# Altium schematic sheet PowerSupply.SchDoc
size A4; DocumentNumber: 1; SheetNumber: 4; SheetTotal: 7
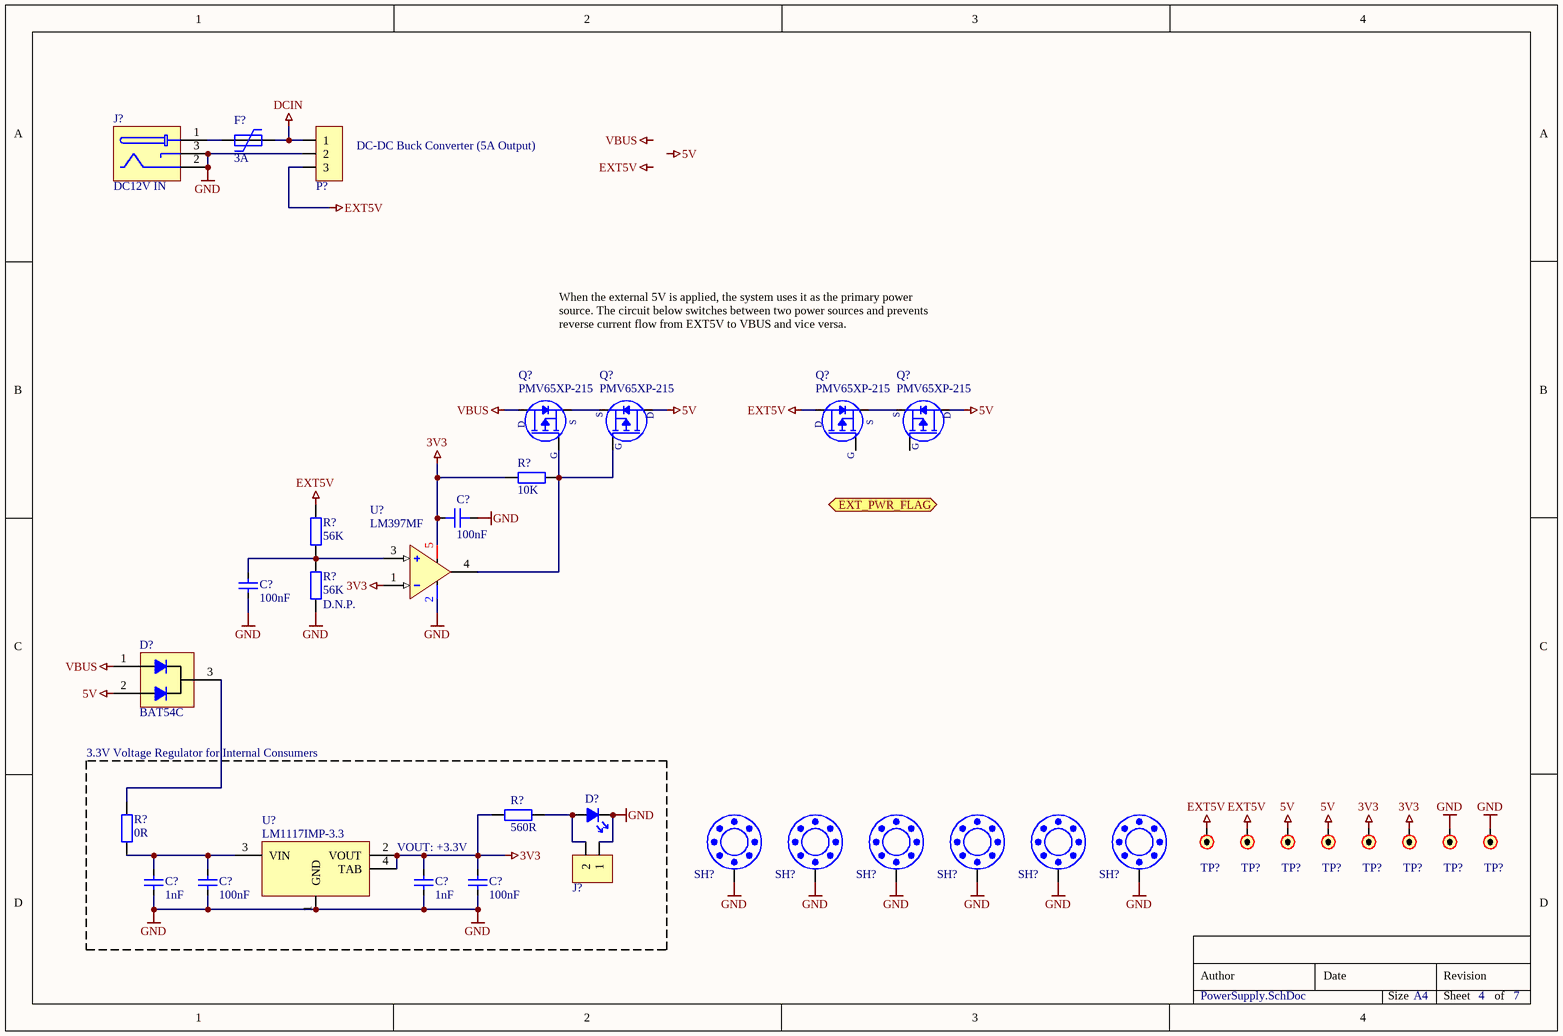
[diagram p0: PowerSupply.SchDoc]

## Parts
(Parts that share a designator on the sheet are numbered #1, #2 ... from top to bottom, then left to right.)
C?#1  100nF  [0603C_RF_M]
C?#2  100nF  [0603C_RF_M]
C?#3  1nF  [0603C_RF_M]
C?#4  100nF  [0603C_RF_M]
C?#5  1nF  [0603C_RF_M]
C?#6  100nF  [0603C_RF_M]
D?#1  BAT54C  [IRLML_SOT-23]
D?#2  LED  [0805LED_RF_M]  (value not drawn)
F?  3A  [BOURNS_MF-MSMF110/16-2_RF_H]
J?#1  DC12V IN  [CON JACK PWR 2.5mm PJ-002BH - duplicate]
J?#2  PINHDR_2x1  [HEADER-2.54-2P1]  (value not drawn)
P?  ED500XDS-3  [ED500XDS-3]  (value not drawn)
Q?#1  PMV65XP-215  [IRLML_SOT-23]
Q?#2  PMV65XP-215  [IRLML_SOT-23]
Q?#3  PMV65XP-215  [IRLML_SOT-23]
Q?#4  PMV65XP-215  [IRLML_SOT-23]
R?#1  10K  [0805R_RF_M]
R?#2  56K  [0805R_RF_M]
R?#3  56K  [0805R_RF_M]
R?#4  560R  [0603R_RF_M]
R?#5  0R  [0603R_RF_M]
SH?#1  SH-30/57  [SH\D3.0\S5.7]  (value not drawn)
SH?#2  SH-30/57  [SH\D3.0\S5.7]  (value not drawn)
SH?#3  SH-30/57  [SH\D3.0\S5.7]  (value not drawn)
SH?#4  SH-30/57  [SH\D3.0\S5.7]  (value not drawn)
SH?#5  SH-30/57  [SH\D3.0\S5.7]  (value not drawn)
SH?#6  SH-30/57  [SH\D3.0\S5.7]  (value not drawn)
TP?#1  Test Point  [PAD_R_1.5MM]  (value not drawn)
TP?#2  Test Point  [PAD_R_1.5MM]  (value not drawn)
TP?#3  Test Point  [PAD_R_1.5MM]  (value not drawn)
TP?#4  Test Point  [PAD_R_1.5MM]  (value not drawn)
TP?#5  Test Point  [PAD_R_1.5MM]  (value not drawn)
TP?#6  Test Point  [PAD_R_1.5MM]  (value not drawn)
TP?#7  Test Point  [PAD_R_1.5MM]  (value not drawn)
TP?#8  Test Point  [PAD_R_1.5MM]  (value not drawn)
U?#1  LM397MF  [TI_SOT-23-5]
U?#2  LM1117IMP-3.3  VOUT: +3.3V  [SOT-223]

## Blocks framed on the sheet
3.3V Voltage Regulator for Internal Consumers: C?#3-C?#6 D?#2 J?#2 R?#4 R?#5 U?#2

## Ports
EXT_PWR_FLAG (out)

## Nets
3V3: C?#1.2 C?#5.2 C?#6.2 R?#1.1 R?#4.2 TP?#5.1 TP?#6.1 U?#1.1(INN) U?#1.5(VDD) U?#2.2(VOUT) U?#2.4(TAB)
5V: D?#1.2(A2) Q?#2.3(Drain) Q?#4.3(Drain) TP?#3.1 TP?#4.1
DCIN: F?.2 P?.1
EXT5V: P?.3 Q?#3.3(Drain) R?#2.1 TP?#1.1 TP?#2.1
GND: C?#1.1 C?#2.1 C?#3.1 C?#4.1 C?#5.1 C?#6.1 D?#2.C J?#1.2 J?#1.3 J?#2.1 P?.2 R?#3.2 SH?#1.1 SH?#2.1 SH?#3.1 SH?#4.1 SH?#5.1 SH?#6.1 TP?#7.1 TP?#8.1 U?#1.2(VSS) U?#2.1(GND)
VBUS: D?#1.1(A1) Q?#1.3(Drain)
NetC?#2_2: C?#2.2 R?#2.2 R?#3.1 U?#1.3(INP)
NetC?#3_2: C?#3.2 C?#4.2 R?#5.1 U?#2.3(VIN)
NetD?#1_3: D?#1.3(C) R?#5.2
NetD?#2_A: D?#2.A J?#2.2 R?#4.1
NetF?_1: F?.1 J?#1.1
NetQ?#1_1: Q?#1.1(Gate) Q?#2.1(Gate) R?#1.2 U?#1.4(OUT)
NetQ?#1_2: Q?#1.2(Source) Q?#2.2(Source)
NetQ?#3_2: Q?#3.2(Source) Q?#4.2(Source)

Not connected (* = marked no-connect by the designer): Q?#3 1(Gate); Q?#4 1(Gate)

## Notes on the sheet
- (near P?) DC-DC Buck Converter (5A Output)
- When the external 5V is applied, the system uses it as the primary power source. The circuit below switches between two power sources and prevents reverse current flow from EXT5V to VBUS and vice versa.
- (near R?#3) D.N.P.
- Labels drawn without touching a wire or pin: 5V, EXT5V, VBUS
- Author
- Date
- Revision
- Size
- A4
- Sheet
- of
- (in symbol PMV65XP-215) D; S; G

## Library data of the parts
C?#1-C?#6 = C: Capacitor; Manufacturer: Generic Brand; Max Voltage: ? V; Tolerance: ?; Manufacturer Part No: *; Supplier: *; Supplier Link: http://; Supplier Part No: *; Category: Capacitor; Mounting Technology: SMT
  C?#1 C?#2 C?#4 C?#6: Value: 100nF
  C?#3 C?#5: Value: 1nF
D?#1 = BAT54C: DIODE ARRAY SCHOTTKY COMM CATH 30V 0.2A SOT-23; PartNo: BAT54C-FDICT-ND; Manufacturer: Diodes Incorporated; DiodeConfiguration: 1 Pair Common Cathode; ProductNumber: BAT54C-7-F; BaseProduct: BAT54C; Supplier: DigiKey; URL: https://www.digikey.com/en/products/detail/diodes-incorporated/BAT54C-7-F/717701; MountingTechnology: SMT; UnitPrice: $0.18; Package: SOT-23-3
D?#2 = LED: Manufacturer: Generic Brand; Emitting Color: Unspecified; Forward Voltage Drop: ? V; Manufacturer Part No: *; Supplier: *; Supplier Link: http://; Supplier Part No: *; Mounting Technology: SMT; Category: Diode
F? = PPTC: Resettable Fuse; Manufacturer: Generic Brand; Max Voltage: ? V; Hold Current: 3A; Category: Fuse; Mounting Technology: SMT; Supplier Link: http://
J?#1 = PJ-002BH: CONN PWR JACK 2.5X5.5MM SOLDER; Manufacturer: CUI Devices; PartNo: CP-002BH-ND; Supplier: DigiKey; ProductNumber: PJ-002BH; URL: https://www.digikey.com/en/products/detail/cui-devices/PJ-002BH/408447; UnitPrice: $0.74; MountType: THT
J?#2 = PINHDR_2x1: Generic Pin Header 2x1
P? = ED500XDS-3: TERM BLK 3P SIDE ENT 5.08MM PCB; Part No: EDZ500/3DS; Rated Current: 15A; Voltage: 300V; URL: https://www.digikey.com/en/products/detail/on-shore-technology-inc/EDZ500-3DS/250583; Datasheet: http://www.on-shore.com/wp-content/uploads/ED500XDS.pdf; Mounting Technology: HMT
Q?#1-Q?#4 = PMV65XP-215: MOSFET P-CH 20V 2.8A 23SOT; Gate-Source Threshold Voltage: -0.69V (typ.); Drain-Source Breakdown Voltage: -20V; Drain Current: -2.8A (max.); Max Gate-Source Voltage: 12V (abs.); Supplier Part No: 1727-3124-1-ND; Supplier: DigiKey; Supplier Link: https://www.digikey.com/en/products/detail/nexperia-usa-inc/PMV65XP-215/949643; Mounting Technology: SMT; Package: SOT-23; Alternative Supplier: Chipdip; Alternative Supplier Link: https://www.chipdip.by/product/pmv65xp.215; Alternative Supplier Part No: 9000037397
R?#1-R?#3 = R: Resistor; Manufacturer: Generic Brand; Power Rating: ? W; Max Voltage: ? V; Tolerance: ?; Supplier Link: http://; Category: Resistor; Mounting Technology: SMT
  R?#1: Value: 10K
  R?#2 R?#3: Value: 56K
R?#4 R?#5 = R: Resistor; Manufacturer: Generic Brand; Max Voltage: ? V; Power Rating: ? W; Tolerance: ?; Manufacturer Part No: *; Supplier: *; Supplier Link: http://; Supplier Part No: *; Category: Resistor; Mounting Technology: SMT
  R?#4: Value: 560R
  R?#5: Value: 0R
SH?#1-SH?#6 = SH-30/57: Screw Hole D3.0/5.7 T/B
TP?#1-TP?#8 = Test Point: Test Point / Pad
U?#1 = LM397MF: IC COMPARATOR VOLT SGL SOT23-5; Manufacturer: Texas Instruments; Product Number: LM397MFX/NOPB; Supplier Part No: LM397MFX/NOPBCT-ND; Supplier: DigiKey; Alternative Supplier: Chipdip; Alternative Supplier Link: https://www.chipdip.by/product/lm397mf-nopb; Alternative Supplier Part No: 9000014932; Supplier Link: https://www.digikey.com/en/products/detail/texas-instruments/LM397MFX-NOPB/1871434; Mounting Technology: SMT; Package: SOT-23-5; Category: IC
U?#2 = LM1117: Voltage Regulator Linear 1% 800mA SOT-223; Manufacturer: Texas Instruments; VIN_MAX: +15V; Case: SOT-223; Product Number: LM1117IMP-3.3; Supplier: Chipdip; Supplier Link: https://www.chipdip.by/product/lm1117imp-3.3-nopb-2; Supplier Part No: 5641124530; Mounting Type: SMT